# EAGLE design Shelly-FTDI (EAGLE 7.7.0)
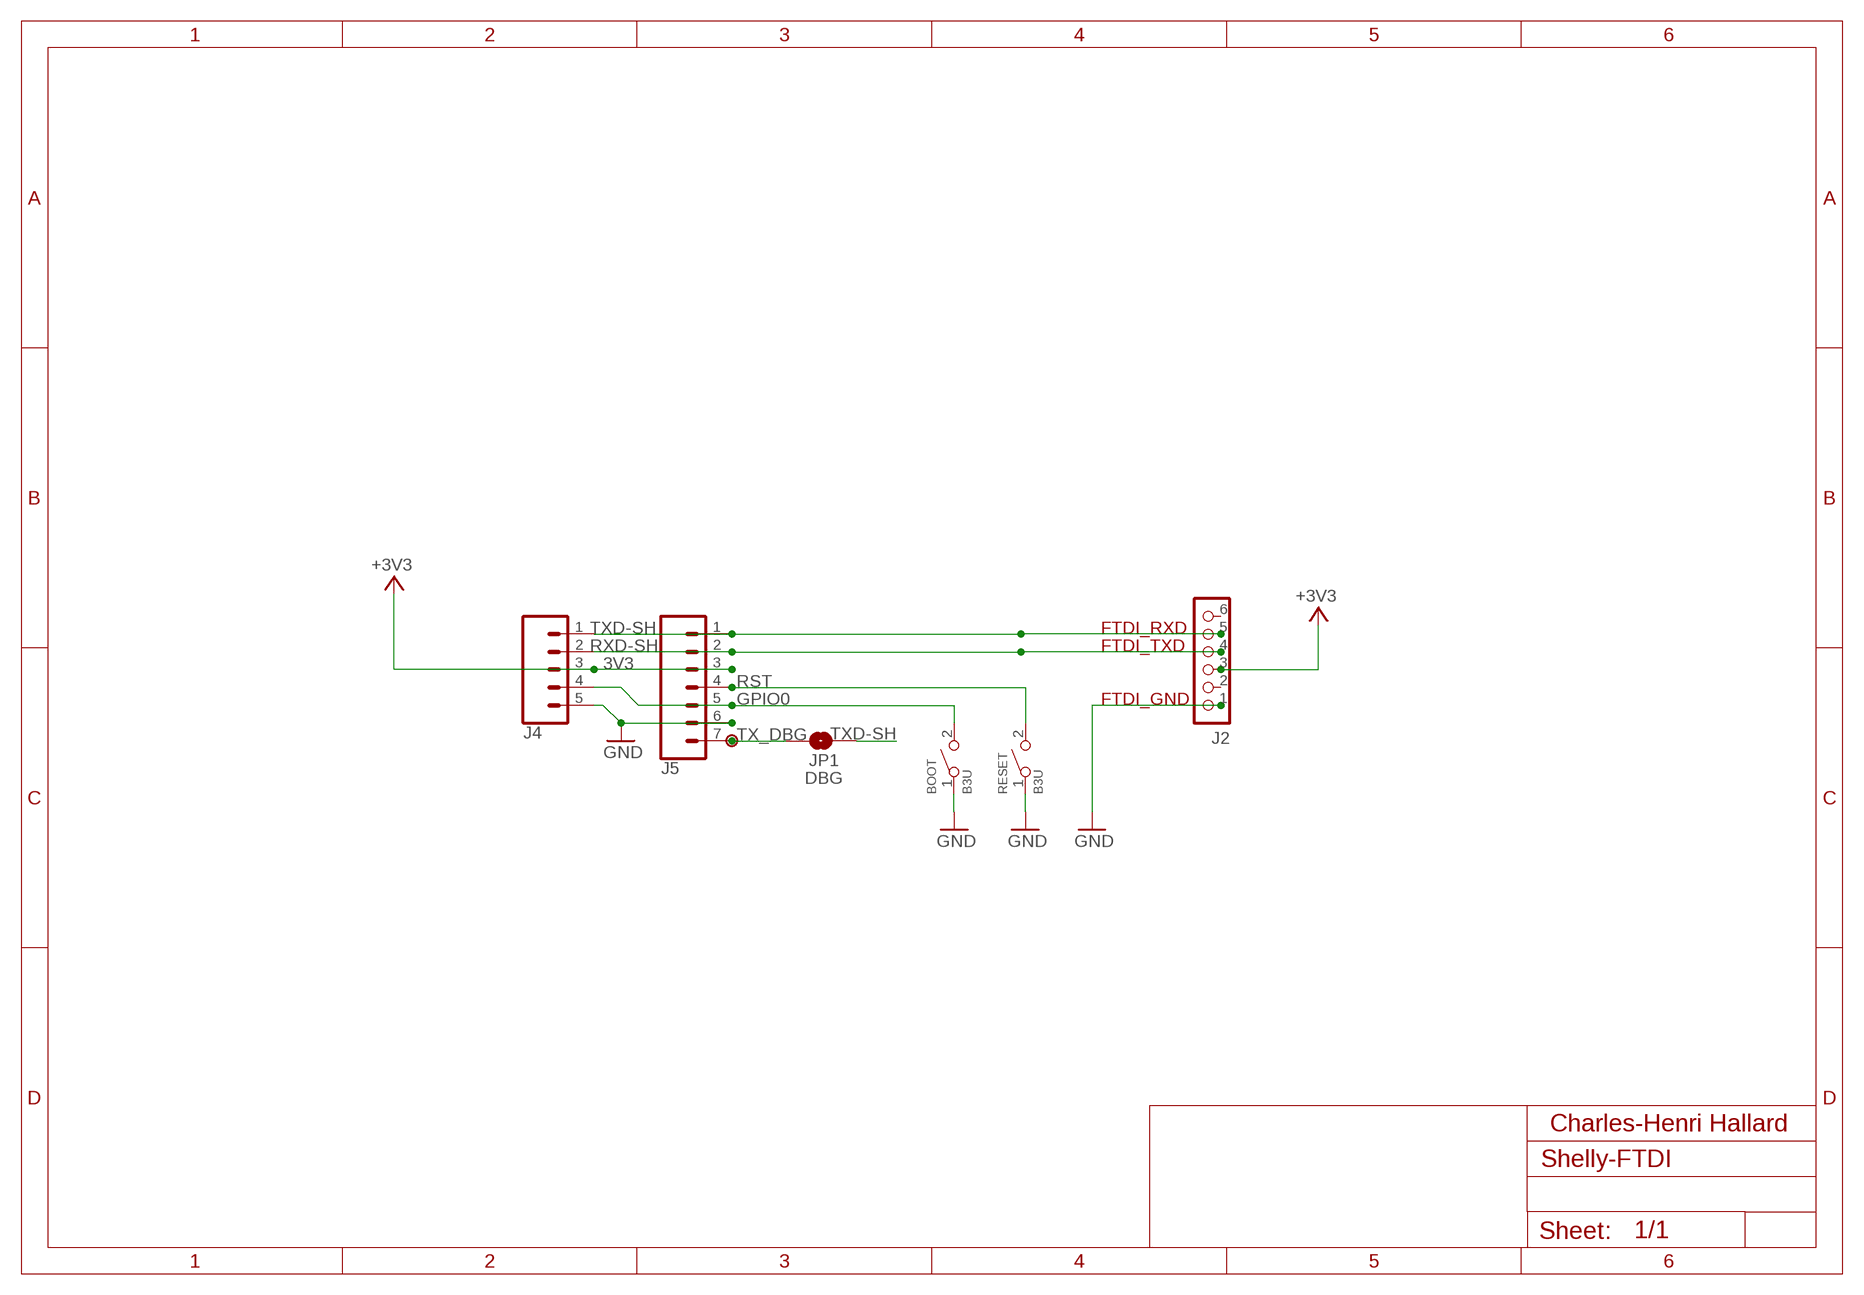
[diagram p0: schematic, sheet 1]

## Parts
BOOT  B3U  SMD-BUTTON(2P-3.0X2.5X1.2+0.4MM)-B3U-1000P-2P-SMD  [SW2-2.6-3.0X2.5X1.2+0.4MM]
J2  CON_HEADER_1X06-PTH  [M1X6]
J4  CONN_051.27MM  [1X05_1.27MM]
J5  CONN_071.27  [1X07_1.27MM]
JP1  DBG  JUMPER-PAD-2-NO  [PAD-JUMPER-2-NO_NO_SILK]
P1  PADSMALL  [PAD-SMALL]
RESET  B3U  SMD-BUTTON(2P-3.0X2.5X1.2+0.4MM)-B3U-1000P-2P-SMD  [SW2-2.6-3.0X2.5X1.2+0.4MM]

## Nets
3V3 [power]: J2.3 J4.3 J5.3 ; supply symbol labelled +3V3
GND [power]: BOOT.1 J2.1 J4.5 J5.6 RESET.1
GPIO0: BOOT.2 J4.4 J5.5
RST: J5.4 RESET.2
RXD-SH: J2.4 J4.2 J5.2
TX_DBG: J5.7 JP1.2 P1.1
TXD-SH: J2.5 J4.1 J5.1 JP1.1
Unconnected: J2.2 J2.6

## Notes on the sheet
- FTDI_RXD
- FTDI_TXD
- FTDI_GND
- Charles-Henri Hallard

## Library data of the parts
BOOT RESET = _c2h:SMD-BUTTON(2P-3.0X2.5X1.2+0.4MM): 311020047; MPN: B3U-1000P-2P-SMD; VALUE: B3U-1000P-2P-SMD
J2 = dp_devices:CON_HEADER_1X06
J4 = SparkFun-Connectors:CONN_05: Multi connection point. Often used as Generic Header-pin footprint for 0.1 inch spaced/style header connections On any of the 0.1 inch spaced packages, you can populate with these: Break Away Headers - Straight <https://www.sparkfun.com/products/116> (PRT-00116) Break Away Male Headers - Right Angle <https://www.sparkfun.com/products/553> (PRT-00553) Female Headers <https://www.sparkfun.com/products/115> (PRT-00115) Break Away Headers - Machine Pin <https://www.sparkfun.com/products/117> (PRT-00117) Break Away Female Headers - Swiss Machine Pin <https://www.sparkfun.com/products/743> (PRT-00743) For SCREWTERMINALS and SPRING TERMINALS visit here: Screw Terimnals on SparkFun.com <https://www.sparkfun.com/search/results?term=Screw+Terminals> (5mm/3.5mm/2.54mm spacing) This device is also useful as a general connection point to wire up your design to another part of your project. Our various solder wires solder well into these plated through hole pads. Hook-Up Wire - Assortment (Stranded, 22 AWG) <https://www.sparkfun.com/products/11375> (PRT-11375) Hook-Up Wire - Assortment (Solid Core, 22 AWG) <https://www.sparkfun.com/products/11367> (PRT-11367) View the entire wire category on our website here <https://www.sparkfun.com/categories/141> Special notes: Molex polarized connector foot print use with SKU : PRT-08231 with associated crimp pins and housings. 1MM SMD Version SKU: PRT-10208
J5 = SparkFun-Connectors:CONN_07: Multi connection point. Often used as Generic Header-pin footprint for 0.1 inch spaced/style header connections On any of the 0.1 inch spaced packages, you can populate with these: Break Away Headers - Straight <https://www.sparkfun.com/products/116> (PRT-00116) Break Away Male Headers - Right Angle <https://www.sparkfun.com/products/553> (PRT-00553) Female Headers <https://www.sparkfun.com/products/115> (PRT-00115) Break Away Headers - Machine Pin <https://www.sparkfun.com/products/117> (PRT-00117) Break Away Female Headers - Swiss Machine Pin <https://www.sparkfun.com/products/743> (PRT-00743) For SCREWTERMINALS and SPRING TERMINALS visit here: Screw Terimnals on SparkFun.com <https://www.sparkfun.com/search/results?term=Screw+Terminals> (5mm/3.5mm/2.54mm spacing) This device is also useful as a general connection point to wire up your design to another part of your project. Our various solder wires solder well into these plated through hole pads. Hook-Up Wire - Assortment (Stranded, 22 AWG) <https://www.sparkfun.com/products/11375> (PRT-11375) Hook-Up Wire - Assortment (Solid Core, 22 AWG) <https://www.sparkfun.com/products/11367> (PRT-11367) View the entire wire category on our website here <https://www.sparkfun.com/categories/141> Special notes: Molex polarized connector foot print use with SKU : PRT-08231 with associated crimp pins and housings. 1MM SMD Version SKU: PRT-10208 NOTES ON THE VARIANTS LOCK and LOCK_LONGPADS... This footprint was designed to help hold the alignment of a through-hole component (i.e. 6-pin header) while soldering it into place. You may notice that each hole has been shifted either up or down by 0.005 of an inch from it's more standard position (which is a perfectly straight line). This slight alteration caused the pins (the squares in the middle) to touch the edges of the holes. Because they are alternating, it causes a "brace" to hold the component in place. 0.005 has proven to be the perfect amount of "off-center" position when using our standard breakaway headers. Although looks a little odd when you look at the bare footprint, once you have a header in there, the alteration is very hard to notice. Also,if you push a header all the way into place, it is covered up entirely on the bottom side.
JP1 = SparkFun-Passives:JUMPER-PAD-2-NO
P1 = _c2h:PAD

## Net classes
0 default: width 0.152 mm, drill 0.356 mm, clearance 0.152 mm
1 power: width 0.203 mm, drill 0.356 mm, clearance 0.152 mm

## Board
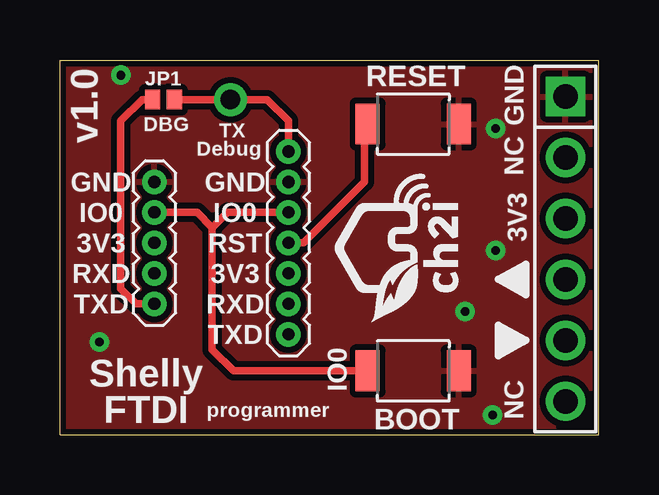
[diagram p1: board, top side]
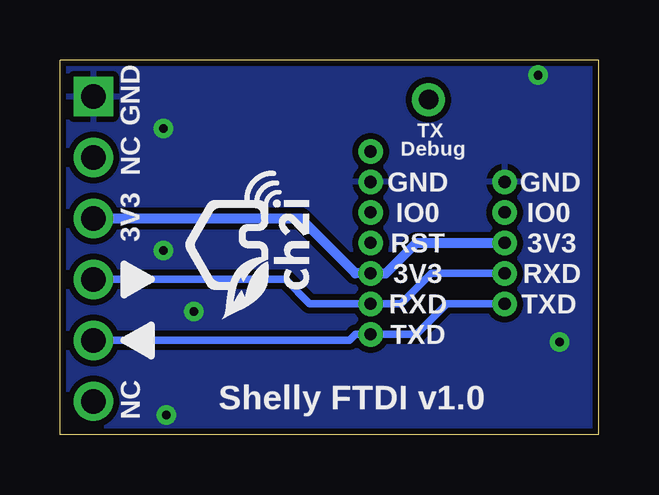
[diagram p2: board, bottom side, seen from below]

Size 22.48 x 15.62 mm. Coordinates in mm from the lower left corner, seen from the top.
Outline: 0,0 0,15.62 22.48,15.62 22.48,0 0,0
Copper layers (1*16): Top 0.035mm / dielectric 1.5mm / Bottom 0.035mm
Design rules "SeeedStudio_2layer_DRU_no_angle_20140221 *": minimum track width 6mil, minimum drill 12mil, track to track 6mil, track to pad 6mil, pad to pad 6mil, via to via 6mil, smd to smd 0mil, copper to edge 10mil, drill to drill 10mil, minimum pad ring 10mil, minimum via ring 6mil, stop-mask expansion 2mil, vias tented up to drill 30mil, thermal gap 10mil

### Footprints (pad centres in the part's own frame; a part is rotated, then mirrored left to right if it is on the bottom)
SW2-2.6-3.0X2.5X1.2+0.4MM = smd 1 x 1.7: 1 -1.9,0; 2 1.9,0
M1X6 = drill 1.02 pad 1.632 square: 1 0,0 | drill 1.02 pad 1.632: 2 2.54,0; 3 5.08,0; 4 7.62,0; 5 10.16,0; 6 12.7,0
1X05_1.27MM = drill 0.508 pad 1: 1 0,0; 2 1.27,0; 3 2.54,0; 4 3.81,0; 5 5.08,0
1X07_1.27MM = drill 0.508 pad 1: 1 -3.81,0; 2 -2.54,0; 3 -1.27,0; 4 0,0; 5 1.27,0; 6 2.54,0; 7 3.81,0
PAD-JUMPER-2-NO_NO_SILK = smd 0.635 x 0.813: 1 -0.45,0; 2 0.45,0
PAD-SMALL = drill 0.813 pad 1.372: 1 0,0

### Placement (x,y rotation side)
BOOT  14.73,2.67 180 top
J2  21.08,14.1 270 top
J4  3.94,5.46 90 top
J5  9.53,8 90 top
JP1  4.32,13.97 0 top
P1  7.11,13.97 0 top
RESET  14.73,12.95 180 top
U$1  [LOGO_C2I_015]  16.64,4.7 90 top
U$2  [LOGO_C2I_015]  12.07,4.83 90 bottom

### Tracks (layer width: path | path; a pad name or v marks a point on that pad's centre or on a via)
3V3
  Bottom 0.406: J2.3 12.45,9.02 10.16,6.73 J5.3 8.89,6.73 7.62,8 J4.3
GND  (via drill 0.36 pad 0.81)
  other vias: 18.16,12.76 18.03,0.83 2.54,14.99 1.65,3.87 16.89,5.14 18.16,7.68
  pour Bottom (isolate 0.254): -1.02,16.83 24,16.76 24,-1.27 -1.02,-1.27
  pour Top (isolate 0.254): -0.38,-0.63 23.37,-0.63 23.37,16.13 -0.38,16.19
GPIO0
  Top 0.305: J4.4 5.71,9.27 6.35,8.64 | BOOT.2 7.24,2.67 6.35,3.56 6.35,8.64 | 6.35,8.64 6.98,9.27 J5.5
RST
  Top 0.305: RESET.2 12.7,12.7 12.7,10.54 10.16,8 J5.4
RXD-SH
  Bottom 0.305: J2.4 13.08,6.48 12.07,5.46 J5.2 8.25,5.46 6.98,6.73 J4.2
TX_DBG
  Top 0.305: J5.7 9.53,13.08 8.64,13.97 P1.1 JP1.2
TXD-SH
  Top 0.305: JP1.1 3.43,13.97 2.54,13.08 2.54,6.1 3.18,5.46 J4.1
  Bottom 0.305: J2.5 10.41,3.94 10.16,4.19 J5.1 7.62,4.19 6.35,5.46 J4.1

### Text on the board
tNames: GND | v1.0 | Debug | TX | NC | GND | GND | IO0 | IO0 | 3V3 | 3V3 | RST | RXD | 3V3 | TXD | RXD | TXD | Shelly | IO0 | FTDI | programmer | NC
bNames: GND | Debug | TX | NC | GND | GND | IO0 | IO0 | 3V3 | 3V3 | RST | RXD | 3V3 | TXD | RXD | TXD | Shelly FTDI v1.0 | NC